# EAGLE design M606X (EAGLE 6.6.0)
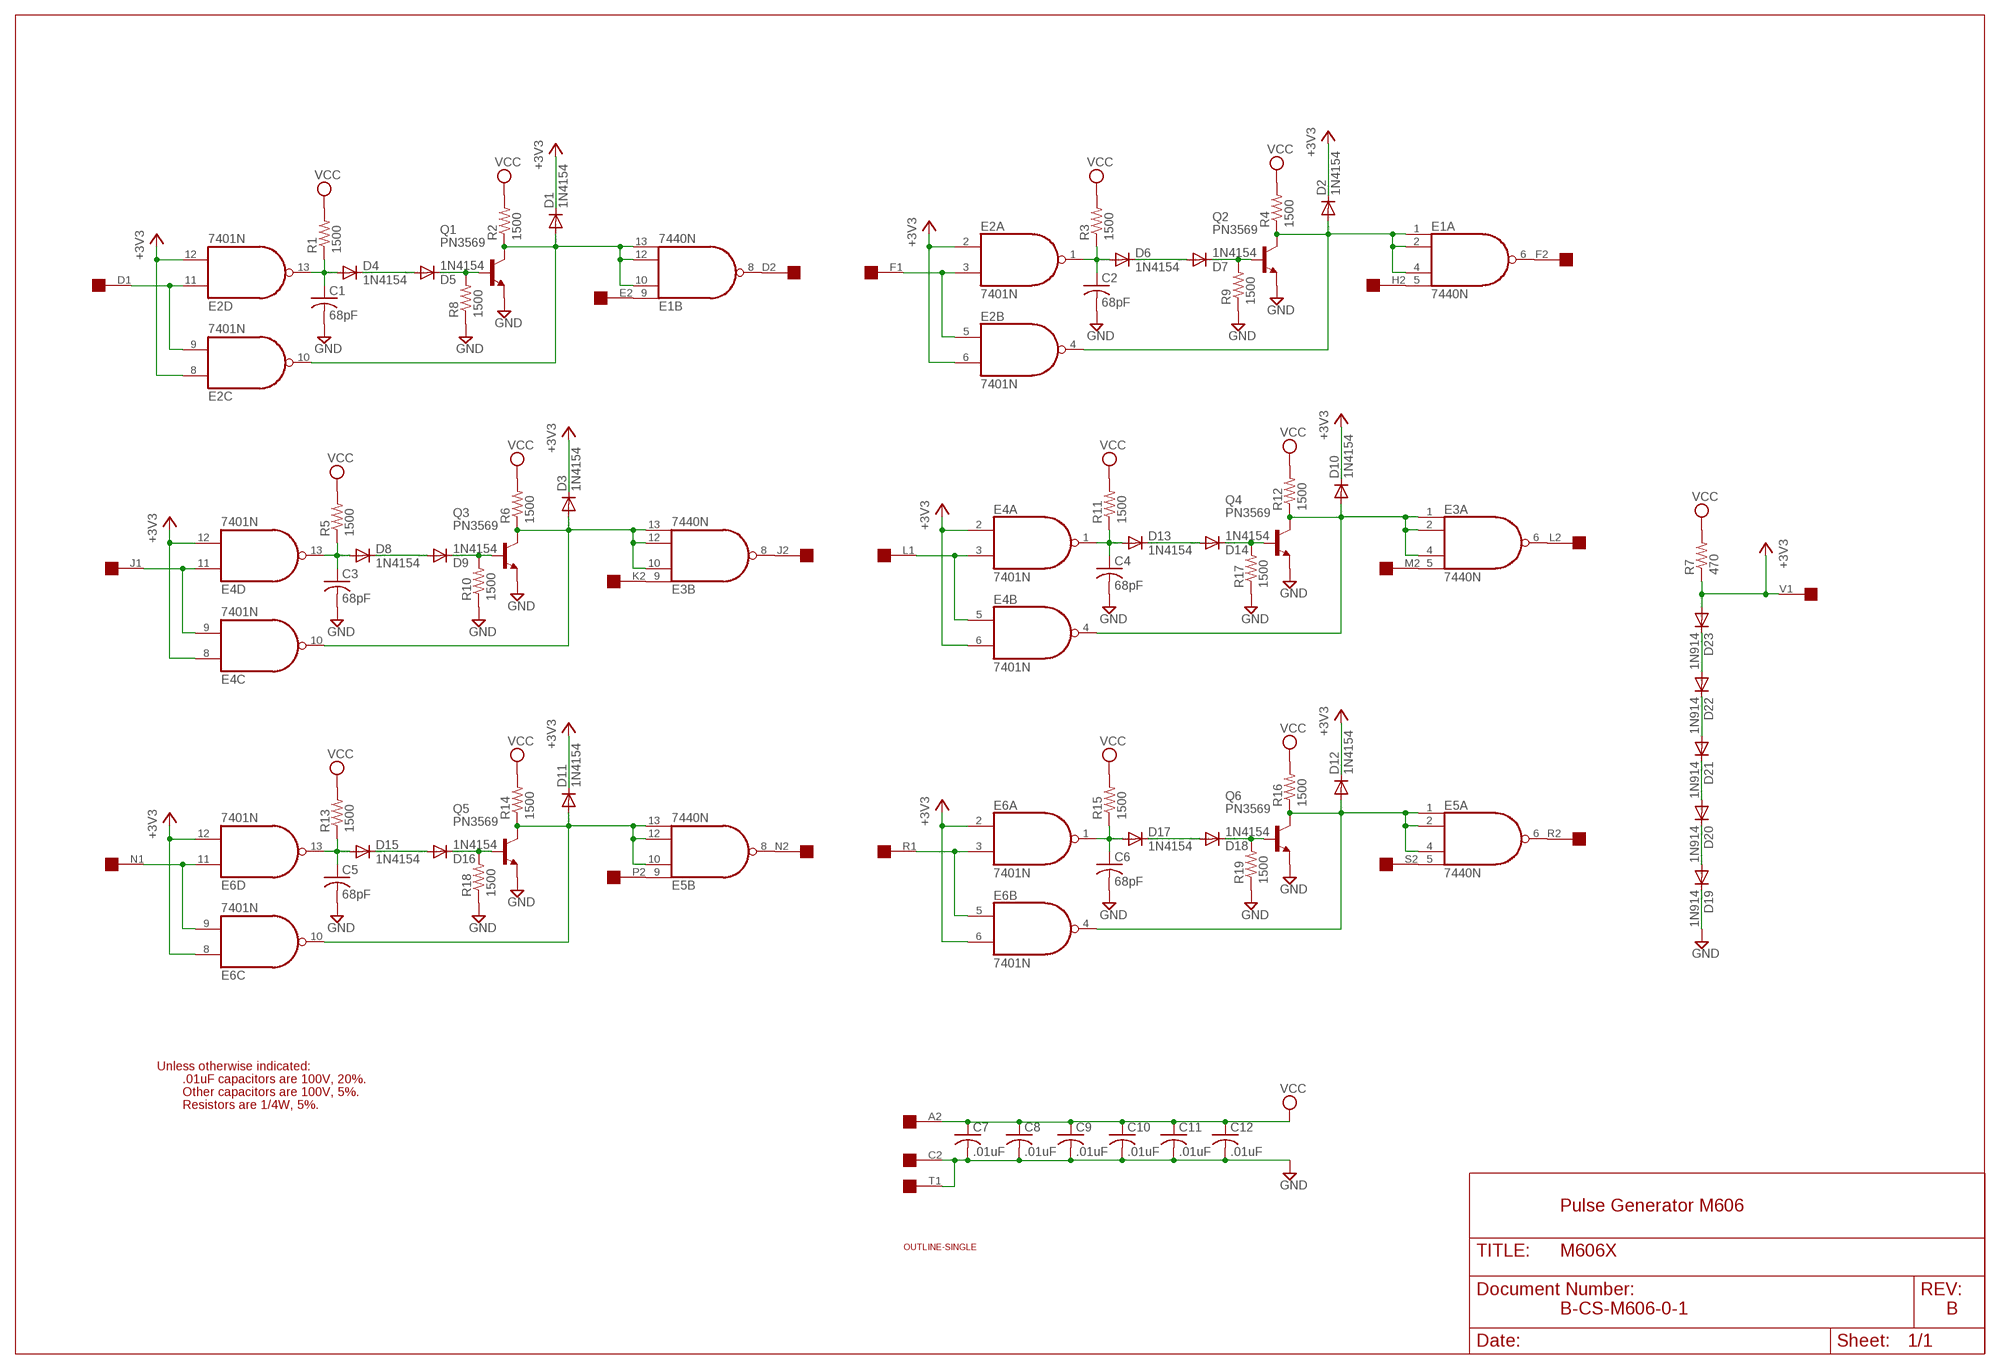
[diagram p0: schematic, sheet 1]

## Parts
C1  68pF  C-US075-032X103  [C075-032X103]
C2  68pF  C-US075-032X103  [C075-032X103]
C3  68pF  C-US075-032X103  [C075-032X103]
C4  68pF  C-US075-032X103  [C075-032X103]
C5  68pF  C-US075-032X103  [C075-032X103]
C6  68pF  C-US075-032X103  [C075-032X103]
C7  .01uF  C-US050-025X075  [C050-025X075]
C8  .01uF  C-US050-025X075  [C050-025X075]
C9  .01uF  C-US050-025X075  [C050-025X075]
C10  .01uF  C-US050-025X075  [C050-025X075]
C11  .01uF  C-US050-025X075  [C050-025X075]
C12  .01uF  C-US050-025X075  [C050-025X075]
D1  1N4154  1N4148DO35-10  [DO35-10]
D2  1N4154  1N4148DO35-10  [DO35-10]
D3  1N4154  1N4148DO35-10  [DO35-10]
D4  1N4154  1N4148DO35-10  [DO35-10]
D5  1N4154  1N4148DO35-10  [DO35-10]
D6  1N4154  1N4148DO35-10  [DO35-10]
D7  1N4154  1N4148DO35-10  [DO35-10]
D8  1N4154  1N4148DO35-10  [DO35-10]
D9  1N4154  1N4148DO35-10  [DO35-10]
D10  1N4154  1N4148DO35-10  [DO35-10]
D11  1N4154  1N4148DO35-10  [DO35-10]
D12  1N4154  1N4148DO35-10  [DO35-10]
D13  1N4154  1N4148DO35-10  [DO35-10]
D14  1N4154  1N4148DO35-10  [DO35-10]
D15  1N4154  1N4148DO35-10  [DO35-10]
D16  1N4154  1N4148DO35-10  [DO35-10]
D17  1N4154  1N4148DO35-10  [DO35-10]
D18  1N4154  1N4148DO35-10  [DO35-10]
D19  1N914  1N4148DO35-10  [DO35-10]
D20  1N914  1N4148DO35-10  [DO35-10]
D21  1N914  1N4148DO35-10  [DO35-10]
D22  1N914  1N4148DO35-10  [DO35-10]
D23  1N914  1N4148DO35-10  [DO35-10]
E1  7440N  74S20N  [DIL14]
E2  7401N  74LS01N  [DIL14]
E3  7440N  74S20N  [DIL14]
E4  7401N  74LS01N  [DIL14]
E5  7440N  74S20N  [DIL14]
E6  7401N  74LS01N  [DIL14]
Q1  PN3569  2N3019  [TO39]
Q2  PN3569  2N3019  [TO39]
Q3  PN3569  2N3019  [TO39]
Q4  PN3569  2N3019  [TO39]
Q5  PN3569  2N3019  [TO39]
Q6  PN3569  2N3019  [TO39]
R1  1500  R-US_0207/10  [0207/10]
R2  1500  R-US_0207/10  [0207/10]
R3  1500  R-US_0207/10  [0207/10]
R4  1500  R-US_0207/10  [0207/10]
R5  1500  R-US_0207/10  [0207/10]
R6  1500  R-US_0207/10  [0207/10]
R7  470  R-US_0207/10  [0207/10]
R8  1500  R-US_0207/10  [0207/10]
R9  1500  R-US_0207/10  [0207/10]
R10  1500  R-US_0207/10  [0207/10]
R11  1500  R-US_0207/10  [0207/10]
R12  1500  R-US_0207/10  [0207/10]
R13  1500  R-US_0207/10  [0207/10]
R14  1500  R-US_0207/10  [0207/10]
R15  1500  R-US_0207/10  [0207/10]
R16  1500  R-US_0207/10  [0207/10]
R17  1500  R-US_0207/10  [0207/10]
R18  1500  R-US_0207/10  [0207/10]
R19  1500  R-US_0207/10  [0207/10]
U$2  SINGLE  [EDGE-CON2]
U$4  OUTLINE-SINGLE  [SINGLE]

## Nets
+3V3 [Supply]: D1.C D2.C D3.C D10.C D11.C D12.C D23.A E2.2(A:I0) E2.6(B:I1) E2.8(C:I0) E2.12(D:I1) E4.2(A:I0) E4.6(B:I1) E4.8(C:I0) E4.12(D:I1) E6.2(A:I0) E6.6(B:I1) E6.8(C:I0) E6.12(D:I1) R7.1 U$2.V1
GND [Supply]: C1.2 C2.2 C3.2 C4.2 C5.2 C6.2 C7.2 C8.2 C9.2 C10.2 C11.2 C12.2 D19.C Q1.1(E) Q2.1(E) Q3.1(E) Q4.1(E) Q5.1(E) Q6.1(E) R8.1 R9.1 R10.1 R17.1 R18.1 R19.1 U$2.C2 U$2.T1
N$1: D4.C D5.A
N$2: D1.A E1.10(B:I1) E1.12(B:I2) E1.13(B:I3) E2.10(C:O) Q1.3(C) R2.1
N$3: D5.C Q1.2(B) R8.2
N$4: D6.C D7.A
N$5: D8.C D9.A
N$6: E1.9(B:I0) U$2.E2
N$7: E1.8(B:O) U$2.D2
N$8: E2.9(C:I1) E2.11(D:I0) U$2.D1
N$9: C1.1 D4.A E2.13(D:O) R1.1
N$10: D15.C D16.A
N$11: E2.3(A:I1) E2.5(B:I0) U$2.F1
N$12: C2.1 D6.A E2.1(A:O) R3.1
N$14: D7.C Q2.2(B) R9.2
N$15: D2.A E1.1(A:I0) E1.2(A:I1) E1.4(A:I2) E2.4(B:O) Q2.3(C) R4.1
N$16: E6.9(C:I1) E6.11(D:I0) U$2.N1
N$17: E4.9(C:I1) E4.11(D:I0) U$2.J1
N$18: C3.1 D8.A E4.13(D:O) R5.1
N$19: D9.C Q3.2(B) R10.2
N$20: D3.A E3.10(B:I1) E3.12(B:I2) E3.13(B:I3) E4.10(C:O) Q3.3(C) R6.1
N$21: D13.C D14.A
N$22: E4.3(A:I1) E4.5(B:I0) U$2.L1
N$23: C4.1 D13.A E4.1(A:O) R11.1
N$24: D14.C Q4.2(B) R17.2
N$25: D10.A E3.1(A:I0) E3.2(A:I1) E3.4(A:I2) E4.4(B:O) Q4.3(C) R12.1
N$26: C5.1 D15.A E6.13(D:O) R13.1
N$27: D16.C Q5.2(B) R18.2
N$28: D11.A E5.10(B:I1) E5.12(B:I2) E5.13(B:I3) E6.10(C:O) Q5.3(C) R14.1
N$29: D17.C D18.A
N$30: E6.3(A:I1) E6.5(B:I0) U$2.R1
N$31: C6.1 D17.A E6.1(A:O) R15.1
N$32: D18.C Q6.2(B) R19.2
N$33: D12.A E5.1(A:I0) E5.2(A:I1) E5.4(A:I2) E6.4(B:O) Q6.3(C) R16.1
N$34: E1.5(A:I3) U$2.H2
N$35: E1.6(A:O) U$2.F2
N$36: E3.8(B:O) U$2.J2
N$37: E3.9(B:I0) U$2.K2
N$38: E3.6(A:O) U$2.L2
N$39: E3.5(A:I3) U$2.M2
N$40: E5.8(B:O) U$2.N2
N$41: E5.9(B:I0) U$2.P2
N$42: E5.6(A:O) U$2.R2
N$43: E5.5(A:I3) U$2.S2
N$45: D22.A D23.C
N$46: D21.A D22.C
N$47: D19.A D20.C
N$48: D20.A D21.C
VCC [Supply]: C7.1 C8.1 C9.1 C10.1 C11.1 C12.1 R1.2 R2.2 R3.2 R4.2 R5.2 R6.2 R7.2 R11.2 R12.2 R13.2 R14.2 R15.2 R16.2 U$2.A2
Unconnected: U$2.A1 U$2.B1 U$2.B2 U$2.C1 U$2.E1 U$2.H1 U$2.K1 U$2.M1 U$2.P1 U$2.S1 U$2.T2 U$2.U1 U$2.U2 U$2.V2

## Notes on the sheet
- Unless otherwise indicated:
- .01uF capacitors are 100V, 20%.
- Other capacitors are 100V, 5%.
- Resistors are 1/4W, 5%.
- Pulse Generator M606
- B-CS-M606-0-1 | B

## Power pins joined to a net without a drawn wire
GND: E1.7(P:GND) E2.7(P:GND) E3.7(P:GND) E4.7(P:GND) E5.7(P:GND) E6.7(P:GND)
VCC: E1.14(P:VCC) E2.14(P:VCC) E3.14(P:VCC) E4.14(P:VCC) E5.14(P:VCC) E6.14(P:VCC)

## Library data of the parts
C1-C12 = rcl:C-US: CAPACITOR, American symbol
D1-D23 = diode:1N4148: DIODE high speed (Philips)
E1 E3 E5 = 74xx-us:74*20: Dual 4-input NAND gate
E2 E4 E6 = 74xx-us:74*01: Quad 2-input NAND gate, open collector
Q1-Q6 = transistor-npn:2N3019: NPN Transistor
R1-R19 = rcl:R-US_: RESISTOR, American symbol
U$2 = dec-con:SINGLE: Single-Height DEC board
U$4 = dec-con:OUTLINE-*: Board outlines for DEC boards.

## Net classes
1 Supply: width 0.813 mm

## Board
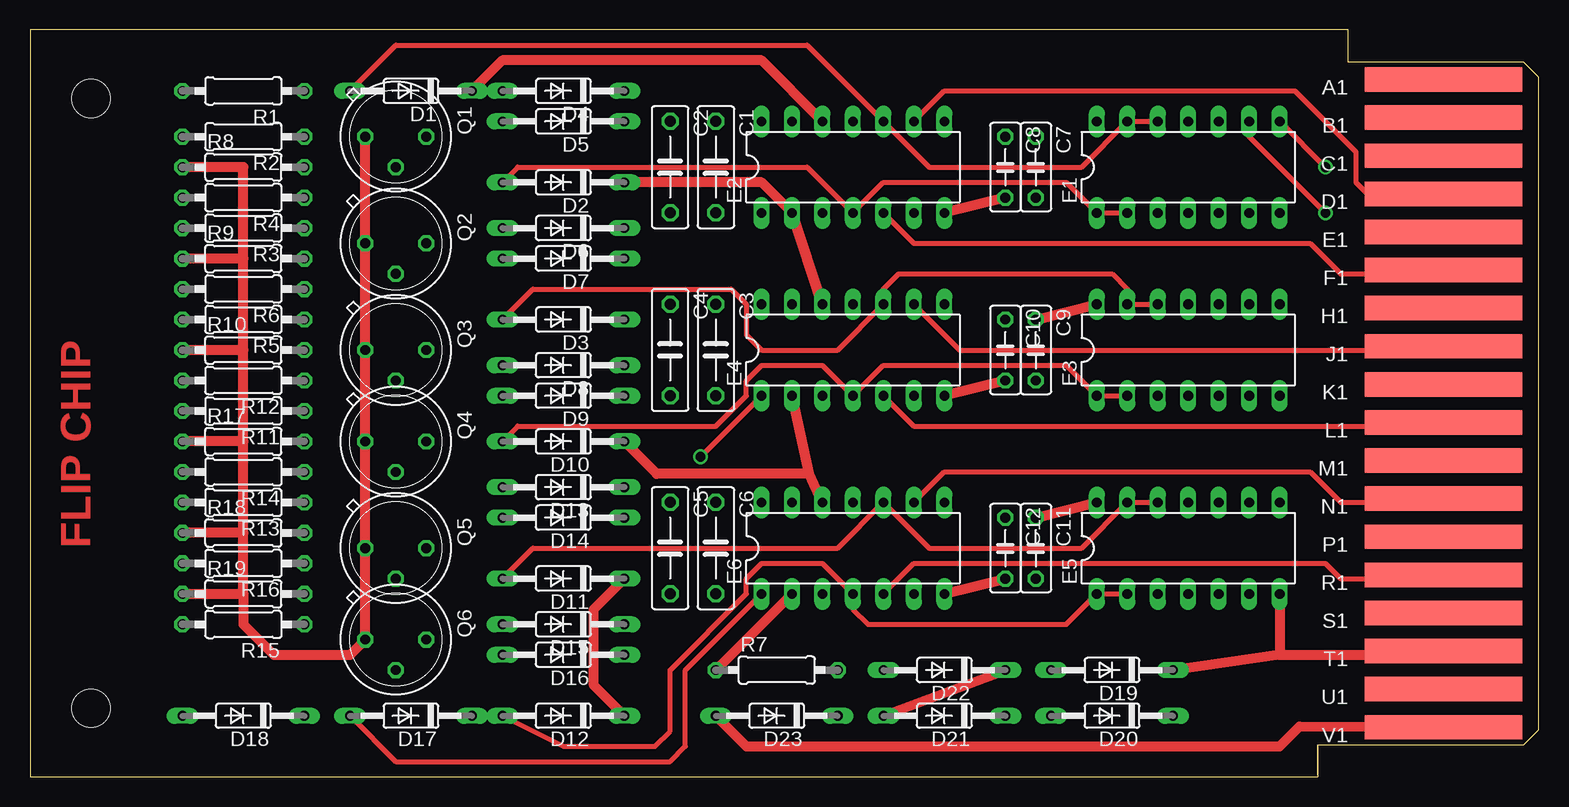
[diagram p1: board, top side]
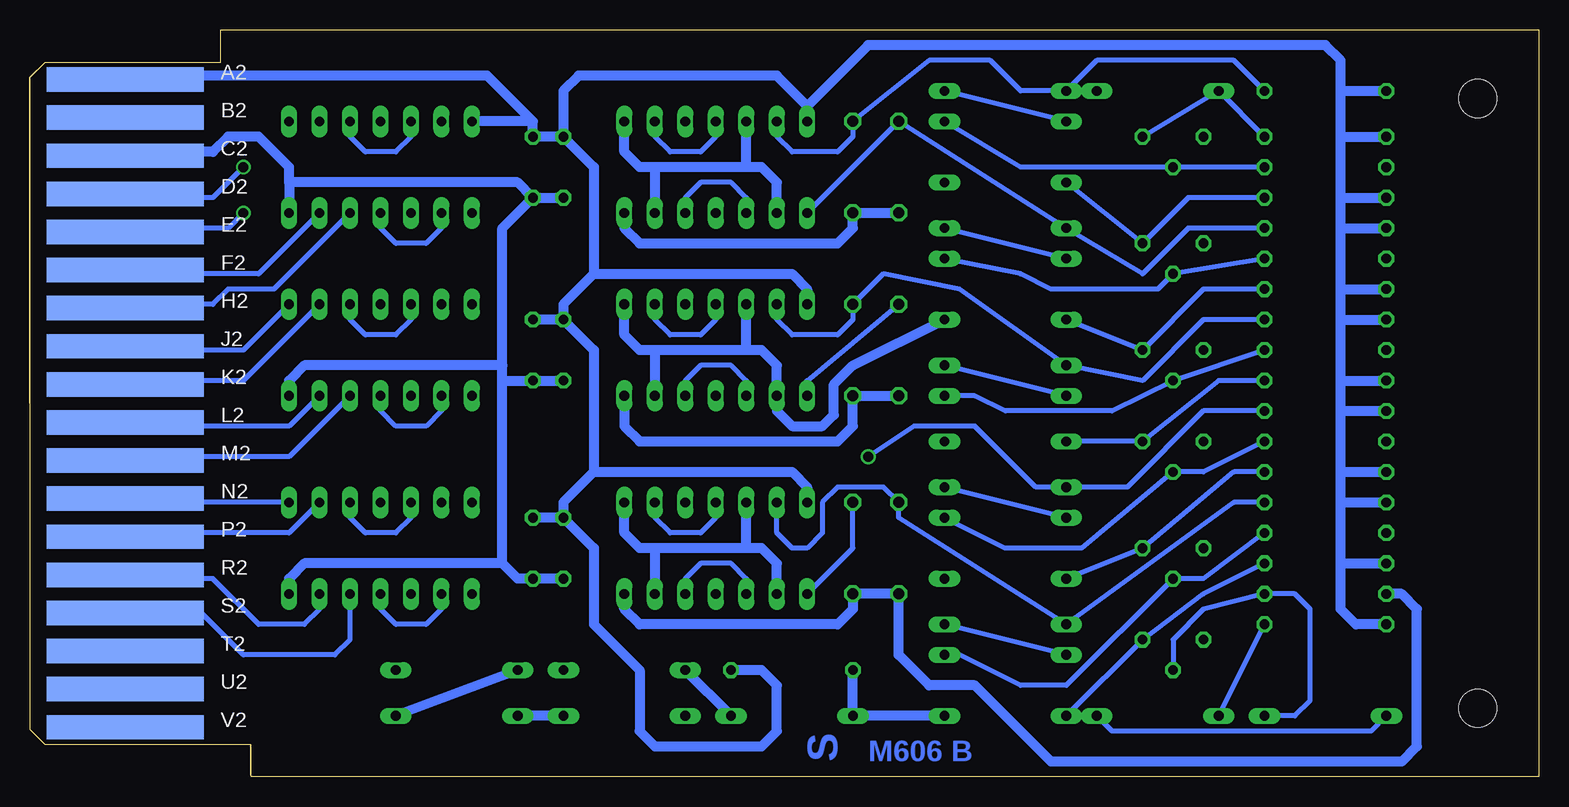
[diagram p2: board, bottom side, seen from below]

Size 125.73 x 62.23 mm. Coordinates in mm from the lower left corner, seen from the top.
Copper layers (1+16): Top 0.035mm / dielectric 1.5mm / Bottom 0.035mm
Design rules "16mils": minimum track width 16mil, minimum drill 32mil, track to track 15mil, track to pad 10mil, pad to pad 10mil, via to via 10mil, smd to smd 10mil, copper to edge 13mil, drill to drill 10mil, minimum pad ring 10mil, minimum via ring 8mil, stop-mask expansion 0mil, vias tented up to drill 0mil, thermal gap 10mil

### Footprints (pad centres in the part's own frame; a part is rotated, then mirrored left to right if it is on the bottom)
C075-032X103 = drill 0.914 octagon: 1 -3.81,0; 2 3.81,0
C050-025X075 = drill 0.813 octagon: 1 -2.54,0; 2 2.54,0
DO35-10 = drill 0.813 long: A 5.08,0; C -5.08,0
DIL14 = drill 0.813 long: 1 -7.62,-3.81; 2 -5.08,-3.81; 3 -2.54,-3.81; 4 0,-3.81; 5 2.54,-3.81; 6 5.08,-3.81; 7 7.62,-3.81; 8 7.62,3.81; 9 5.08,3.81; 10 2.54,3.81; 11 0,3.81; 12 -2.54,3.81; 13 -5.08,3.81; 14 -7.62,3.81
TO39 = drill 0.813 octagon: 1 0,-2.54; 2 2.54,0; 3 0,2.54
0207/10 = drill 0.813 octagon: 1 -5.08,0; 2 5.08,0
EDGE-CON2 = smd 13.106 x 2.032: A1 7.938,4.128; B1 7.938,7.303; C1 7.938,10.477; D1 7.938,13.652; E1 7.938,16.828; F1 7.938,20.003; H1 7.938,23.177; J1 7.938,26.352; K1 7.938,29.527; L1 7.938,32.703; M1 7.938,35.877; N1 7.938,39.053; P1 7.938,42.227; R1 7.938,45.403; S1 7.938,48.578; T1 7.938,51.752; U1 7.938,54.928; V1 7.938,58.102 | smd 13.106 x 2.032 bottom: A2 7.938,4.128; B2 7.938,7.303; C2 7.938,10.477; D2 7.938,13.652; E2 7.938,16.828; F2 7.938,20.003; H2 7.938,23.177; J2 7.938,26.352; K2 7.938,29.527; L2 7.938,32.703; M2 7.938,35.877; N2 7.938,39.053; P2 7.938,42.227; R2 7.938,45.403; S2 7.938,48.578; T2 7.938,51.752; U2 7.938,54.928; V2 7.938,58.102
SINGLE = hole 3.175: 120.65,56.515; 120.65,5.715

### Placement (x,y rotation side)
C1  57.15,50.8 270 top
C2  53.34,50.8 270 top
C3  57.15,35.56 270 top
C4  53.34,35.56 270 top
C5  53.34,19.05 270 top
C6  57.15,19.05 270 top
C7  83.82,50.8 270 top
C8  81.28,50.8 270 top
C9  83.82,35.56 270 top
C10  81.28,35.56 270 top
C11  83.82,19.05 270 top
C12  81.28,19.05 270 top
D1  31.75,57.15 180 top
D2  44.45,49.53 180 top
D3  44.45,38.1 180 top
D4  44.45,57.15 180 top
D5  44.45,54.61 180 top
D6  44.45,45.72 180 top
D7  44.45,43.18 180 top
D8  44.45,34.29 180 top
D9  44.45,31.75 180 top
D10  44.45,27.94 180 top
D11  44.45,16.51 180 top
D12  44.45,5.08 180 top
D13  44.45,24.13 180 top
D14  44.45,21.59 180 top
D15  44.45,12.7 180 top
D16  44.45,10.16 180 top
D17  31.75,5.08 180 top
D18  17.78,5.08 180 top
D19  90.17,8.89 180 top
D20  90.17,5.08 180 top
D21  76.2,5.08 180 top
D22  76.2,8.89 180 top
D23  62.23,5.08 180 top
E1  96.52,50.8 0 top
E2  68.58,50.8 0 top
E3  96.52,35.56 0 top
E4  68.58,35.56 0 top
E5  96.52,19.05 0 top
E6  68.58,19.05 0 top
Q1  30.48,53.34 270 top
Q2  30.48,44.45 270 top
Q3  30.48,35.56 270 top
Q4  30.48,27.94 270 top
Q5  30.48,19.05 270 top
Q6  30.48,11.43 270 top
R1  17.78,57.15 180 top
R2  17.78,53.34 180 top
R3  17.78,45.72 180 top
R4  17.78,48.26 180 top
R5  17.78,38.1 180 top
R6  17.78,40.64 180 top
R7  62.23,8.89 0 top
R8  17.78,50.8 0 top
R9  17.78,43.18 0 top
R10  17.78,35.56 0 top
R11  17.78,30.48 180 top
R12  17.78,33.02 180 top
R13  17.78,22.86 180 top
R14  17.78,25.4 180 top
R15  17.78,12.7 180 top
R16  17.78,17.78 180 top
R17  17.78,27.94 0 top
R18  17.78,20.32 0 top
R19  17.78,15.24 0 top
U$1  [FLIPCHIP]  0,0 0 top
U$2  125.73,62.23 180 top
U$4  125.73,62.23 180 top

### Tracks (layer width: path | path; a pad name or v marks a point on that pad's centre or on a via)
+3V3
  Top 0.813: U$2.V1 105.8,4.2 104.14,2.54 59.69,2.54 D23.A | R7.1 E6.2 | E4.12 E2.2 60.96,49.53 D2.C | E6.12 64.93,25.24 | 64.93,25.24 E4.2 | D10.C 52.23,25.24 64.93,25.24 | D11.C 46.99,13.97 46.99,7.62 D12.C | E2.12 60.96,59.69 39.37,59.69 D1.C
  Bottom 0.813: R7.1 D23.A D12.C | E2.2 63.5,49.53 64.77,50.8 66.04,50.8 | 66.04,50.8 E2.12 | 73.66,50.8 E2.6 | 66.04,50.8 73.66,50.8 | E2.8 76.2,52.07 74.93,50.8 73.66,50.8 | 66.04,35.56 64.77,35.56 63.5,34.29 E4.2 63.5,30.48 62.23,29.21 59.69,29.21 58.74,30.16 58.74,32.7 57.15,34.29 D3.C | 66.04,35.56 E4.12 | E4.8 76.2,36.83 74.93,35.56 73.66,35.56 | 66.04,35.56 73.66,35.56 | 73.66,35.56 E4.6 | E6.2 63.5,17.78 64.77,19.05 66.04,19.05 | 66.04,19.05 E6.12 | E6.8 76.2,20.32 74.93,19.05 73.66,19.05 | 66.04,19.05 73.66,19.05 | 73.66,19.05 E6.6
GND
  Top 0.813: R19.1 17.78,15.24 | 17.78,15.24 17.78,20.32 | 17.78,20.32 R18.1 | R8.1 17.78,50.8 17.78,43.18 | 17.78,43.18 R9.1 | 17.78,35.56 R10.1 | 17.78,35.56 17.78,43.18 | 17.78,27.94 R17.1 | 17.78,20.32 17.78,27.94 | 17.78,27.94 17.78,35.56 | C8.2 E2.7 | E6.7 C12.2 | C10.2 E4.7 | Q1.1 Q2.1 Q3.1 Q4.1 Q5.1 Q6.1 26.67,10.16 20.32,10.16 17.78,12.7 17.78,15.24 | U$2.T1 117.17,10.49 116.84,10.16 104.14,10.16 | 104.14,10.16 D19.C | E5.7 104.14,10.16
  Bottom 0.813: E6.7 76.2,13.97 74.93,12.7 58.42,12.7 57.15,13.97 C6.2 C5.2 53.34,10.16 50.8,7.62 46.99,7.62 40.64,1.27 11.43,1.27 10.16,2.54 10.16,13.97 11.43,15.24 R19.1 | E4.7 76.2,29.21 74.93,27.94 58.42,27.94 57.15,29.21 C3.2 C4.2 | E2.7 76.2,45.72 74.93,44.45 58.42,44.45 57.15,45.72 C1.2 C2.2 | C10.2 C9.2 86.36,33.02 | C12.2 C11.2 85.09,16.51 86.36,17.78 | 86.36,17.78 86.36,33.02 | C7.2 86.36,45.72 86.36,34.29 | 86.36,33.02 86.36,34.29 | C7.2 C8.2 | U$2.C2 117.17,51.74 116.84,52.07 110.49,52.07 109.22,53.34 106.68,53.34 104.14,50.8 104.14,49.53 | 104.14,49.53 E1.7 | C7.2 85.09,49.53 104.14,49.53 | E3.7 104.14,33.02 102.87,34.29 86.36,34.29 | E5.7 104.14,16.51 102.87,17.78 86.36,17.78
N$1
  Bottom 0.406: D5.A D4.C
N$2
  Top 0.406: E1.12 E1.13 87.63,50.8 74.93,50.8 E2.10 64.77,60.96 30.48,60.96 D1.A
  Bottom 0.406: E1.10 99.06,53.34 97.79,52.07 95.25,52.07 93.98,53.34 E1.12 | R2.1 D1.A Q1.3
N$3
  Bottom 0.406: R8.2 Q1.2 43.18,50.8 D5.C
N$4
  Bottom 0.406: D7.A D6.C
N$5
  Bottom 0.406: D9.A D8.C
N$6  (via drill 0.81)
  Top 0.406: v107.95,46.99 101.6,53.34 E1.9
  Bottom 0.406: U$2.E2 117.17,45.39 116.84,45.72 109.22,45.72 v107.95,46.99
N$7  (via drill 0.81)
  Top 0.406: E1.8 v107.95,50.8
  Bottom 0.406: U$2.D2 117.14,48.56 116.84,48.26 110.49,48.26 v107.95,50.8
N$8
  Top 0.406: U$2.D1 116.84,48.26 111.76,48.26 110.49,49.53 110.49,52.07 105.41,57.15 76.2,57.15 E2.9
  Bottom 0.406: E2.11 68.58,53.34 69.85,52.07 72.39,52.07 73.66,53.34 E2.9
N$9
  Bottom 0.406: R1.1 25.4,59.69 36.83,59.69 D4.A 43.18,57.15 45.72,59.69 50.8,59.69 C1.1 57.15,53.34 58.42,52.07 62.23,52.07 63.5,53.34 E2.13
N$10
  Bottom 0.406: D16.A D15.C
N$11
  Top 0.406: U$2.F1 117.12,42.19 114.3,41.91 109.22,41.91 106.68,44.45 73.66,44.45 E2.5
  Bottom 0.406: E2.3 66.04,48.26 67.31,49.53 69.85,49.53 71.12,48.26 E2.5
N$12
  Bottom 0.406: E2.1 C2.1 D6.A 33.02,41.91 29.21,45.72 R3.1
N$14
  Bottom 0.406: R9.2 Q2.2 31.75,40.64 40.64,40.64 43.18,41.91 D7.C
N$15
  Top 0.406: E1.2 E1.1 86.36,49.53 71.12,49.53 E2.4 64.77,50.8 40.64,50.8 D2.A
  Bottom 0.406: E1.2 91.44,45.72 92.71,44.45 95.25,44.45 96.52,45.72 E1.4 | D2.A Q2.3 29.21,48.26 R4.1
N$16
  Top 0.406: E6.9 76.2,25.4 106.68,25.4 109.22,22.86 116.84,22.86 U$2.N1
  Bottom 0.406: E6.11 68.58,21.59 69.85,20.32 72.39,20.32 73.66,21.59 E6.9
N$17
  Top 0.406: U$2.J1 117.17,35.89 116.84,35.56 77.47,35.56 E4.9
  Bottom 0.406: E4.11 68.58,38.1 69.85,36.83 72.39,36.83 73.66,38.1 E4.9
N$18
  Bottom 0.406: E4.13 63.5,38.1 62.23,36.83 58.42,36.83 57.15,38.1 C3.1 54.61,41.91 48.26,40.64 D8.A 33.02,33.02 27.94,38.1 R5.1
N$19
  Bottom 0.406: R10.2 Q3.2 35.56,30.48 44.45,30.48 46.99,31.75 D9.C
N$20
  Top 0.406: E3.12 E3.13 91.44,40.64 90.17,41.91 72.39,41.91 71.12,40.64 E4.10 67.31,35.56 60.96,35.56 59.69,36.83 59.69,39.37 58.42,40.64 41.91,40.64 D3.A
  Bottom 0.406: E3.12 93.98,38.1 95.25,36.83 97.79,36.83 99.06,38.1 E3.10 | R6.1 27.94,40.64 Q3.3 D3.A
N$21
  Bottom 0.406: D14.A D13.C
N$22
  Top 0.406: U$2.L1 116.84,29.21 73.66,29.21 E4.5
  Bottom 0.406: E4.3 66.04,33.02 67.31,34.29 69.85,34.29 71.12,33.02 E4.5
N$23  (via drill 0.81)
  Top 0.406: v55.88,26.67 E4.1
  Bottom 0.406: E4.1 60.96,33.02 C4.1 | v55.88,26.67 52.07,29.21 46.99,29.21 41.91,24.13 D13.A 34.29,24.13 27.94,30.48 R11.1
N$24
  Bottom 0.406: R17.2 27.94,25.4 Q4.2 38.1,19.05 44.45,19.05 D14.C
N$25
  Top 0.406: E3.2 E3.1 86.36,34.29 71.12,34.29 E4.4 66.04,34.29 60.96,34.29 59.69,33.02 59.69,31.75 57.15,29.21 40.64,29.21 D10.A
  Bottom 0.406: E3.2 91.44,30.48 92.71,29.21 95.25,29.21 96.52,30.48 E3.4 | R12.1 26.67,33.02 Q4.3 D10.A
N$26
  Bottom 0.406: E6.13 63.5,20.32 62.23,19.05 60.96,19.05 59.69,20.32 59.69,22.86 58.42,24.13 54.61,24.13 C5.1 53.34,21.59 D15.A 25.4,22.86 R13.1
N$27
  Bottom 0.406: R18.2 27.94,16.51 Q5.2 39.37,7.62 43.18,7.62 48.26,10.16 D16.C
N$28
  Top 0.406: E5.12 E5.13 87.63,19.05 74.93,19.05 E6.10 67.31,19.05 41.91,19.05 D11.A
  Bottom 0.406: E5.12 93.98,21.59 95.25,20.32 97.79,20.32 99.06,21.59 E5.10 | R14.1 25.4,25.4 Q5.3 D11.A
N$29
  Bottom 0.406: D18.A 13.97,3.81 35.56,3.81 D17.C
N$30
  Top 0.406: U$2.R1 116.84,16.51 109.22,16.51 107.95,17.78 73.66,17.78 E6.5
  Bottom 0.406: E6.3 66.04,16.51 67.31,17.78 69.85,17.78 71.12,16.51 E6.5
N$31
  Top 0.406: E6.1 54.61,8.89 54.61,2.54 53.34,1.27 30.48,1.27 D17.A
  Bottom 0.406: E6.1 57.15,19.05 C6.1 | D17.A R15.1
N$32
  Bottom 0.406: Q6.2 30.48,11.43 27.94,13.97 R19.2 20.32,15.24 19.05,13.97 19.05,6.35 20.32,5.08 D18.C
N$33
  Top 0.406: E5.2 E5.1 86.36,12.7 69.85,12.7 68.58,13.97 E6.4 66.04,17.78 60.96,17.78 59.69,16.51 59.69,15.24 53.34,8.89 53.34,3.81 52.07,2.54 44.45,2.54 D12.A
  Bottom 0.406: E5.2 91.44,13.97 92.71,12.7 95.25,12.7 96.52,13.97 E5.4 | R16.1 27.94,15.24 Q6.3 D12.A
N$34
  Bottom 0.406: U$2.H2 117.17,39.04 116.84,39.37 110.49,39.37 109.22,40.64 105.41,40.64 E1.5
N$35
  Bottom 0.406: U$2.F2 117.12,42.19 116.84,41.91 106.68,41.91 E1.6
N$36
  Bottom 0.406: U$2.J2 117.17,35.89 116.84,35.56 107.95,35.56 E3.8
N$37
  Bottom 0.406: U$2.K2 117.14,32.72 116.84,33.02 107.95,33.02 E3.9
N$38
  Bottom 0.406: U$2.L2 117.17,29.54 116.84,29.21 104.14,29.21 E3.6
N$39
  Bottom 0.406: U$2.M2 117.17,26.34 116.84,26.67 104.14,26.67 E3.5
N$40
  Bottom 0.406: U$2.N2 117.17,23.19 116.84,22.86 E5.8
N$41
  Bottom 0.406: U$2.P2 117.17,19.99 116.84,20.32 104.14,20.32 E5.9
N$42
  Bottom 0.406: U$2.R2 117.17,16.84 116.84,16.51 110.49,16.51 106.68,12.7 102.87,12.7 101.6,13.97 E5.6
N$43
  Bottom 0.406: U$2.S2 117.14,13.66 116.84,13.97 111.76,13.97 107.95,10.16 100.33,10.16 99.06,11.43 E5.5
N$45
  Bottom 0.813: D23.C D22.A
N$46
  Top 0.813: D21.A D22.C
N$47
  Bottom 0.813: D19.A D20.C
N$48
  Bottom 0.813: D21.C D20.A
VCC
  Top 0.813: C11.1 E5.14 | C9.1 E3.14
  Bottom 0.813: U$2.A2 117.24,58.02 116.84,58.42 87.63,58.42 83.82,54.61 | C8.1 C7.1 83.82,54.61 | 60.96,55.88 63.5,58.42 80.01,58.42 81.28,57.15 C8.1 | 60.96,55.88 E2.14 | 60.96,55.88 55.88,60.96 17.78,60.96 16.51,59.69 16.51,57.15 | 16.51,17.78 16.51,13.97 15.24,12.7 R15.2 | 16.51,17.78 16.51,22.86 | 16.51,22.86 16.51,25.4 | 16.51,25.4 16.51,30.48 | 16.51,30.48 16.51,33.02 | 16.51,33.02 16.51,38.1 | 16.51,38.1 16.51,40.64 | 16.51,40.64 16.51,45.72 | 16.51,45.72 16.51,48.26 | 16.51,48.26 16.51,53.34 | 16.51,53.34 16.51,57.15 | 16.51,17.78 R16.2 | 16.51,22.86 R13.2 | 16.51,57.15 R1.2 | 16.51,53.34 R2.2 | 16.51,48.26 R4.2 | 16.51,40.64 R6.2 | 16.51,38.1 R5.2 | 16.51,33.02 R12.2 | 16.51,30.48 R11.2 | 16.51,25.4 R14.2 | 16.51,45.72 R3.2 | E6.14 60.96,24.13 62.23,25.4 78.74,25.4 | 78.74,25.4 81.28,22.86 C12.1 | C12.1 C11.1 | C10.1 78.74,35.56 78.74,25.4 | C10.1 81.28,39.37 78.74,41.91 | 78.74,41.91 78.74,50.8 C8.1 | E4.14 60.96,40.64 62.23,41.91 78.74,41.91 | 83.82,54.61 E1.14 | R7.2 64.77,8.89 63.5,7.62 63.5,3.81 64.77,2.54 73.66,2.54 74.93,3.81 74.93,8.89 78.74,12.7 78.74,19.05 C12.1 | C10.1 C9.1

### Text on the board
Bottom: M606 B | S